# Altium schematic sheet TPS2663.SchDoc
size 431 x 279 mm; Date: Not shown in title block; ApprovedBy: Not shown in title block; CheckedBy: Not shown in title block; Author: Not shown in title block; CompanyName: Not shown in title block; DrawnBy: Andy Lin (TI); Engineer: Not shown in title block; Organization: Not shown in title block; Address1: Not shown in title block; Address2: Not shown in title block; Address3: Not shown in title block; Address4: Not shown in title block; DocumentNumber: 5; Revision: Use project parameter SCH_Rev; SheetNumber: 5; SheetTotal: 14; PageSetup: Record=PageOptions|CenterHorizontal=True|CenterVertical=True|PrintScale=1.00|XCorrection=1.00|YCorrection=1.00|PrintKind=0|BorderSize=5000000|LeftOffset=0|BottomOffset=0|Orientation=2|PaperLength=1000|PaperWidth=1000|Scale=100|PaperSource=15|PrintQuality=600|MediaType=1|DitherType=10|PaperKind=Letter|PrintScaleMode=1; CurrentTime: Not shown in title block; CurrentDate: Not shown in title block; Time: Not shown in title block; DocumentFullPathAndName: Not shown in title block; DocumentName: Not shown in title block; ModifiedDate: Not shown in title block; ImagePath: Not shown in title block
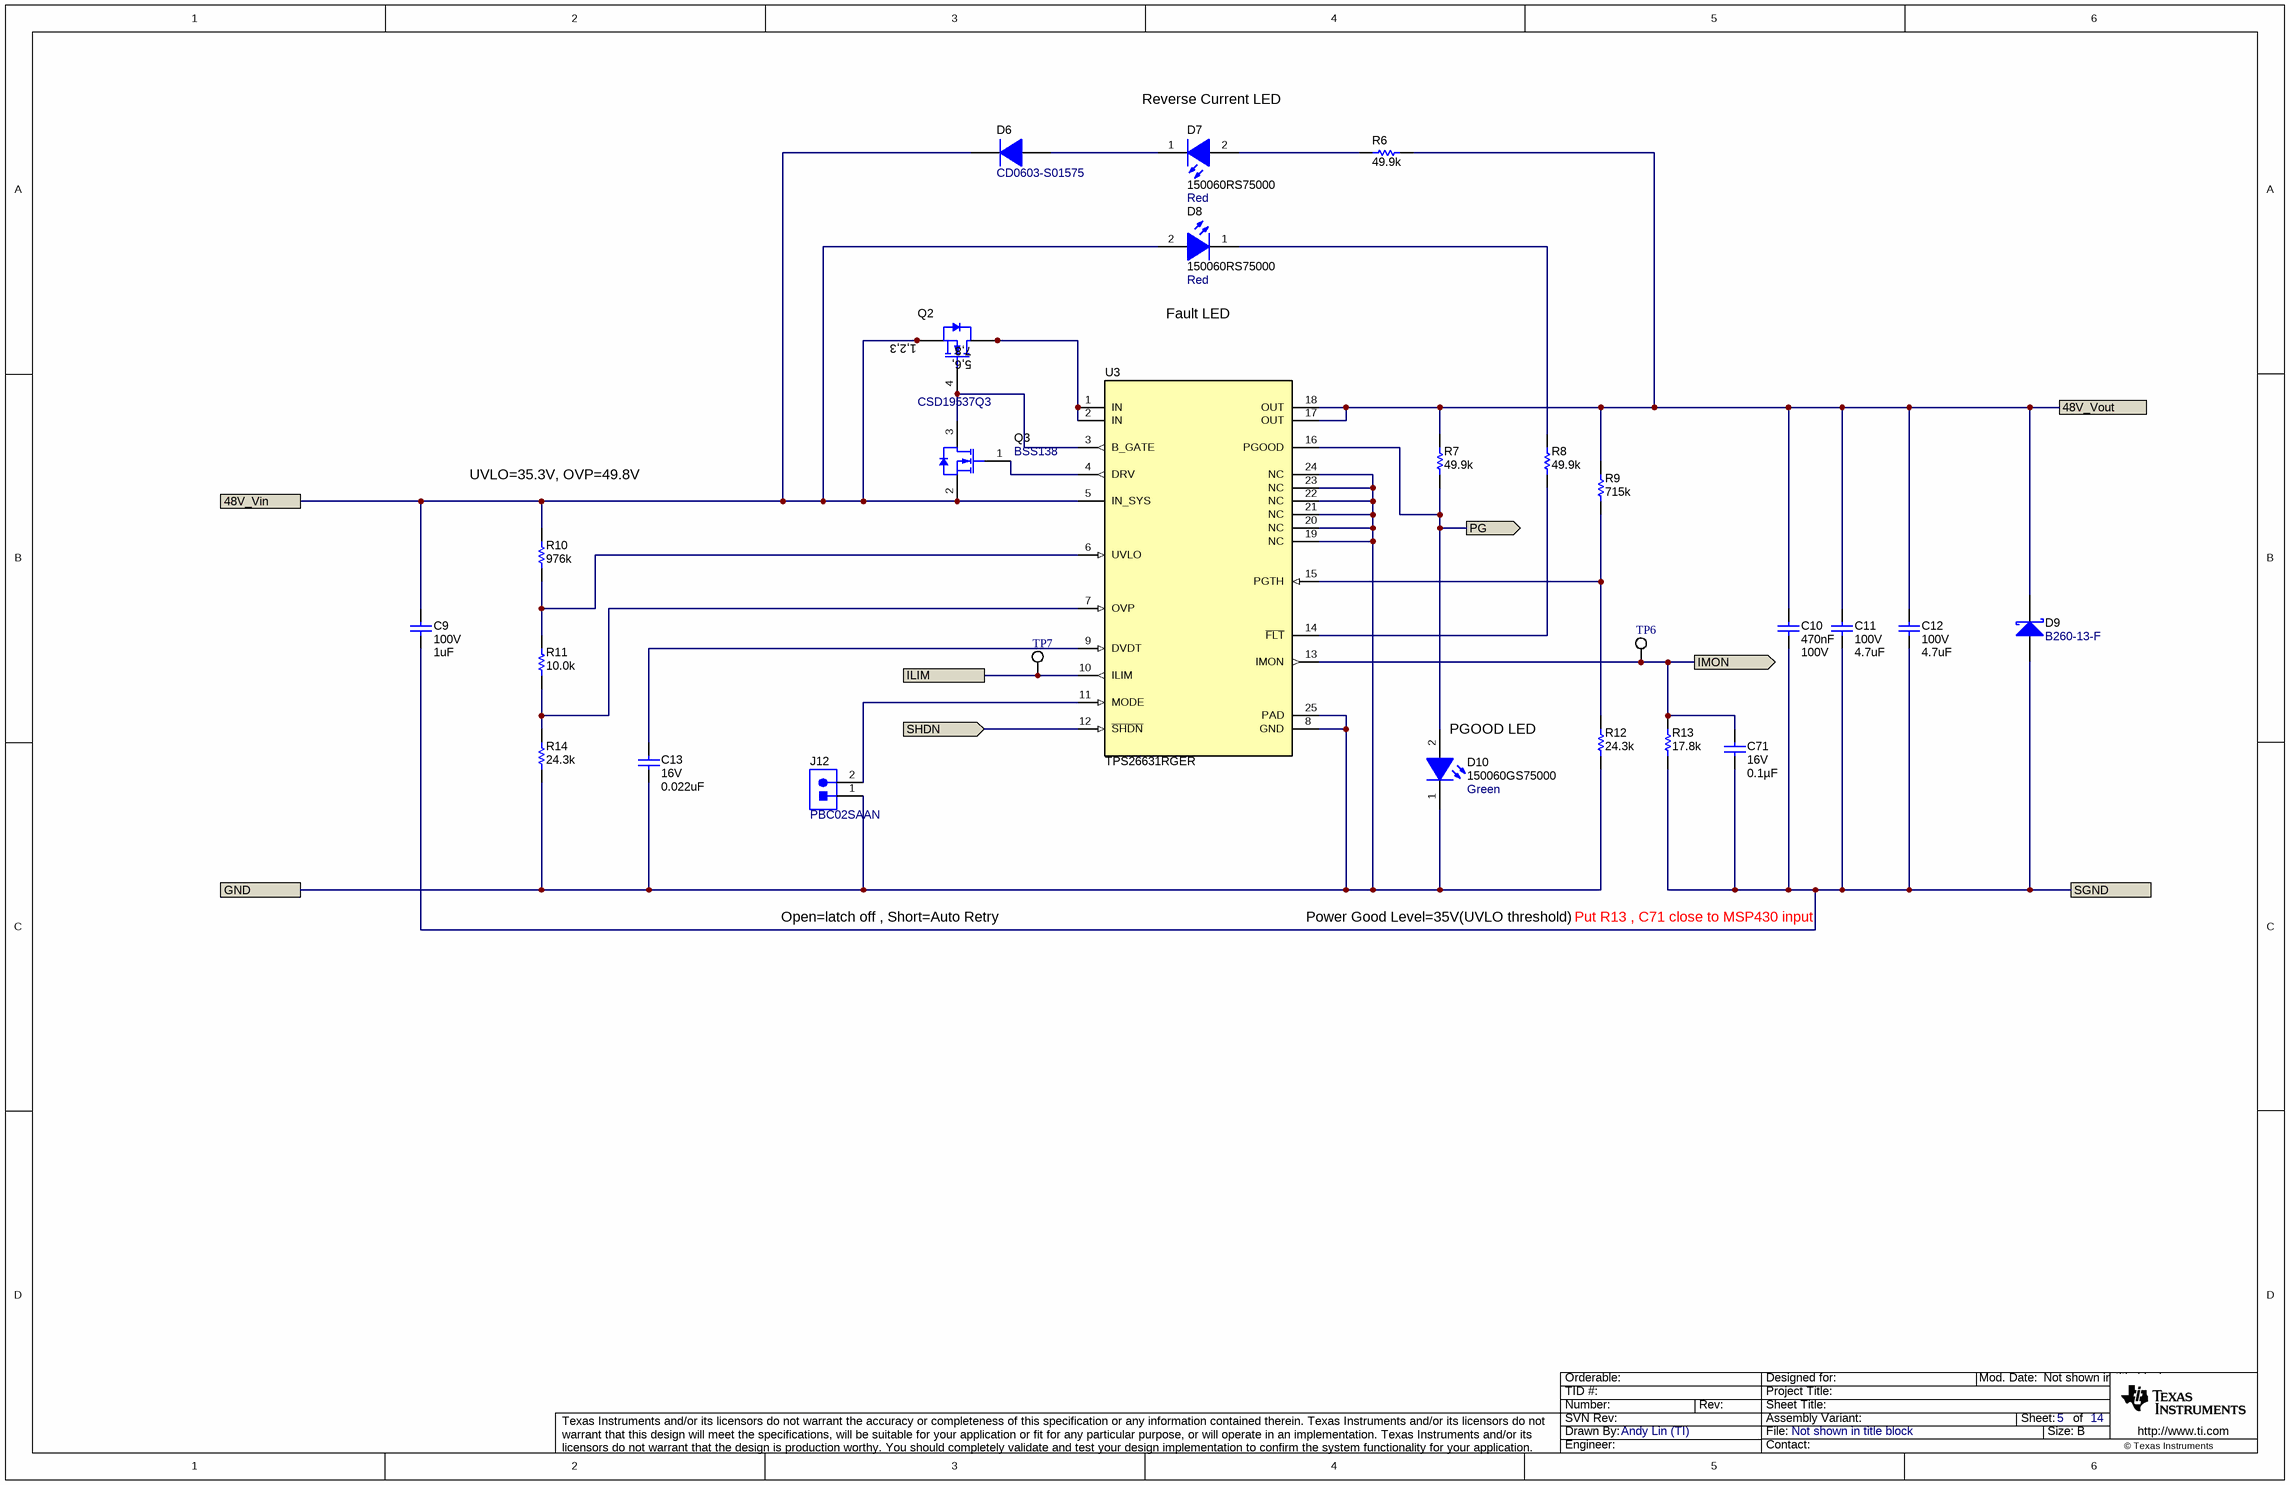
[diagram p0: TPS2663.SchDoc]

## Parts
C9  VDC_V: 100V  ValueDisplayed: 1uF  [1206_180]  (hidden comment: GRM31CR72A105KA01L)
C10  Cap_F: 470nF  VDC_V: 100V  [0805_HV]  (hidden comment: GRM21BR72A474KA73L)
C11  VDC_V: 100V  ValueDisplayed: 4.7uF  [1210_220]  (hidden comment: GRM32DC72A475KE01L)
C12  VDC_V: 100V  ValueDisplayed: 4.7uF  [1210_220]  (hidden comment: GRM32DC72A475KE01L)
C13  VDC_V: 16V  ValueDisplayed: 0.022uF  [0402]  (hidden comment: GRM155R71C223KA01D)
C71  VDC_V: 16V  ValueDisplayed: 0.1µF  [0402]  (hidden comment: GCM155R71C104JA55D)
D6  CD0603-S01575  [Diode_0603]
D7  150060RS75000  value Red  [WL-SMCW_RED]
D8  150060RS75000  value Red  [WL-SMCW_RED]
D9  B260-13-F  [SMB]
D10  150060GS75000  value Green  [WL-SMCW_GREEN]
J12  PBC02SAAN  [Sullins_PBC02SAAN]
Q2  CSD19537Q3  [DQG0008A]
Q3  BSS138  [SOT-23]
R6  ValueDisplayed: 49.9k  [0603]  (hidden comment: CRCW060349K9FKEA)
R7  ValueDisplayed: 49.9k  [0603]  (hidden comment: CRCW060349K9FKEA)
R8  ValueDisplayed: 49.9k  [0603]  (hidden comment: CRCW060349K9FKEA)
R9  ValueDisplayed: 715k  [0402]  (hidden comment: CRCW0402715KFKED)
R10  ValueDisplayed: 976k  [0402]  (hidden comment: CRCW0402976KFKED)
R11  ValueDisplayed: 10.0k  [0402]  (hidden comment: CRCW040210K0FKED)
R12  ValueDisplayed: 24.3k  [0402]  (hidden comment: CRCW040224K3FKED)
R13  ValueDisplayed: 17.8k  [0402]  (hidden comment: CRCW040217K8FKED)
R14  ValueDisplayed: 24.3k  [0402]  (hidden comment: CRCW040224K3FKED)
TP6  5002  [Keystone5002]  (value not drawn)
TP7  5002  [Keystone5002]  (value not drawn)
U3  TPS26631RGER  [RGE0024H]

## Ports
48V_Vin, 48V_Vout, GND, ILIM, IMON (out), PG (out), SGND, SHDN (in)

## Nets
48V_Vin: C9.1 D6.1(K) D8.2(A) Q2.1(S) Q2.2(S) Q2.3(S) Q3.2(S) R10.2 U3.5(IN_SYS) ; port 48V_Vin
48V_Vout: C10.1 C11.1 C12.1 D9.1(K) R6.1 R7.2 R9.2 U3.17(OUT) U3.18(OUT) ; port 48V_Vout
GND: C13.2 D10.1(K) J12.1 R12.1 R14.1 U3.8(GND) U3.19(NC) U3.20(NC) U3.21(NC) U3.22(NC) U3.23(NC) U3.24(NC) U3.25(PAD) ; port GND
ILIM: TP7.1 U3.10(ILIM) ; port ILIM
IMON: C71.1 R13.2 TP6.1 U3.13(IMON) ; port IMON
PG: D10.2(A) R7.1 U3.16(PGOOD) ; port PG
SGND: C9.2 C10.2 C11.2 C12.2 C71.2 D9.2(A) R13.1 ; port SGND
SHDN: U3.12(~{SHDN}) ; port SHDN
NetC13_1: C13.1 U3.9(DVDT)
NetD6_2: D6.2(A) D7.1(K)
NetD7_2: D7.2(A) R6.2
NetD8_1: D8.1(K) R8.2
NetJ12_2: J12.2 U3.11(MODE)
NetQ2_4: Q2.4(G) Q3.3(D) U3.3(B_GATE)
NetQ2_5: Q2.5(D) Q2.6(D) Q2.7(D) Q2.8(D) Q2.9(D) U3.1(IN) U3.2(IN)
NetQ3_1: Q3.1(G) U3.4(DRV)
NetR8_1: R8.1 U3.14(~{FLT})
NetR9_1: R9.1 R12.2 U3.15(PGTH)
NetR10_1: R10.1 R11.2 U3.6(UVLO)
NetR11_1: R11.1 R14.2 U3.7(OVP)

## Notes on the sheet
- (near D7) Reverse Current LED
- Fault LED
- UVLO=35.3V, OVP=49.8V
- (near D10) PGOOD LED
- Open=latch off , Short=Auto Retry
- Power Good Level=35V(UVLO threshold)
- Put R13 , C71 close to MSP430 input
- Drawn By:
- SVN Rev:
- Number:
- TID #:
- Orderable:
- Rev:
- Sheet Title:
- File:
- Project Title:
- Designed for:
- Assembly Variant:
- Mod. Date:
- Sheet:
- Size:
- of
- B
- http://www.ti.com
- Texas Instruments and/or its licensors do not warrant the accuracy or completeness of this specification or any information contained therein. Texas Instruments and/or its licensors do not warrant that this design will meet the specifications, will be suitable for your application or fit for any particular purpose, or will operate in an implementation. Texas Instruments and/or its licensors do not warrant that the design is production worthy. You should completely validate and test your design implementation to confirm the system functionality for your application.
- Engineer:
- Contact:
- © Texas Instruments
- (in symbol CMP-0000967-2) 1,2,3; 7,8; 5,6,

## Library data of the parts
C9 = CMP-0008970-1: CAP, CERM, 1 uF, 100 V, +/- 10%, X7R, 1206; Manufacturer: MuRata; TaMin_C: -55°C; Polarized: N; SizeAreaWB_mm2: 10.92; Value1: Unknown; U/M: EA; Value: 1uF; TaMax_C: 125°C; SizeZ_mm: 1.8; SizeX_mm: 3.2; SizeY_mm: 1.6; Cap_Case: 2220; SizeArea_mm2: 5.12; Cap_F: 1µF; AEC Category: Q200; ComponentLink1URL: http://search.murata.co.jp/Ceramy/PnsearchViewAction.do?HnOFG=ON&HnNFG=ON&SEL_CNT=50&sLang=en&sKey=GRM31CR72A105KA01L&x=9&y=9&search=startwith; Supplier Part Number 2: 81-GRM31CR72A105KA01; Publisher: Texas Instruments; Supplier 2: Mouser; Supplier Part Number 3: 1735543; TempCo: X7R; Supplier 3: Farnell; Published: 2008-06-19; RoHS: Y; MountType: SMT; Supplier 1: Digi-Key; PackageReference: 1206; Tolerance_%: 10%; Value2: 100V; CompType: Capacitor; LatestRevisionDate: 2017-03-09; PartNumber: GRM31CR72A105KA01L; AEC Qualified: ?; ComponentLink1Description: Datasheet link; Supplier Part Number 1: 490-3909-1-ND; Technology: Ceramic
C10 = CMP-0008374-2: CAP, CERM, 0.47 uF, 100 V, +/- 10%, X7R, 0805; Manufacturer: MuRata; TaMin_C: -55°C; Polarized: N; SizeAreaWB_mm2: 6.75; Value1: Unknown; U/M: EA; Value: 0.47uF; TaMax_C: 125°C; SizeZ_mm: 1.45; SizeX_mm: 2; SizeY_mm: 1.25; Cap_Case: 0805; SizeArea_mm2: 2.5; AEC Category: Q200; Supplier Part Number 2: 81-GRM21BR72A474KA73; Publisher: Texas Instruments; Supplier 2: Mouser; TempCo: X7R; Published: 2008-06-19; RoHS: Y; MountType: SMT; Supplier 1: Digi-Key; PackageReference: 0805; Tolerance_%: 10%; Value2: 100V; CompType: Capacitor; LatestRevisionDate: 2017-03-09; PartNumber: GRM21BR72A474KA73L; AEC Qualified: ?; ComponentLink1Description: Datasheet link; Supplier Part Number 1: 490-3326-1-ND; Technology: Ceramic; ValueDisplayed: 0.47uF; ComponentLink1URL: http://search.murata.co.jp/Ceramy/PnsearchViewAction.do?HnOFG=ON&HnNFG=ON&SEL_CNT=50&sLang=en&sKey=GRM21BR72A474KA73L&x=9&y=9&search=startwith
C11 C12 = CMP-0009182-2: CAP, CERM, 4.7 uF, 100 V, +/- 10%, X7S, 1210; Manufacturer: MuRata; TaMin_C: -55°C; Polarized: N; SizeAreaWB_mm2: 14.7; Value1: Unknown; U/M: EA; Value: 4.7uF; TaMax_C: 125°C; SizeZ_mm: 2.2; SizeX_mm: 3.2; SizeY_mm: 2.5; Cap_Case: 1210; SizeArea_mm2: 8; Cap_F: 4.7µF; AEC Category: Q200; Publisher: Texas Instruments; TempCo: X7S; Published: 2008-06-19; RoHS: Y; MountType: SMT; Supplier 1: Mouser; PackageReference: 1210; Tolerance_%: 10%; Value2: 100V; CompType: Capacitor; LatestRevisionDate: 2017-03-09; PartNumber: GRM32DC72A475KE01L; AEC Qualified: N; ComponentLink1Description: Datasheet link; AEC Grade: N/A; Supplier Part Number 1: 81-GRM32DC72A475KE1L; Technology: Ceramic; ComponentLink1URL: http://search.murata.co.jp/Ceramy/image/img/A01X/G101/ENG/GRM32DC72A475KE01-01.pdf
C13 = CMP-0006647-2: CAP, CERM, 0.022 uF, 16 V, +/- 10%, X7R, 0402; Manufacturer: MuRata; TaMin_C: -55°C; Polarized: N; SizeAreaWB_mm2: 3; Value1: Unknown; U/M: EA; TaMax_C: 125°C; SizeZ_mm: 0.6; SizeX_mm: 1; SizeY_mm: 0.5; Cap_F: 22nF; AEC Category: Q200; Supplier Part Number 2: 81-GRM36X223K16; Publisher: Texas Instruments; Supplier 2: Mouser; Supplier Part Number 3: 1828865; TempCo: X7R; Supplier 3: Farnell; Published: 2008-06-19; RoHS: Y; MountType: SMT; Value: 0.022uF; Supplier 1: Digi-Key; PackageReference: 0402; Tolerance_%: 10%; Cap_Case: 0402; Value2: 16V; SizeArea_mm2: 0.5; CompType: Capacitor; LatestRevisionDate: 2017-03-09; PartNumber: GRM155R71C223KA01D; AEC Qualified: ?; ComponentLink1Description: Datasheet link; Supplier Part Number 1: 490-3256-1-ND; Technology: Ceramic; ComponentLink1URL: http://search.murata.co.jp/Ceramy/PnsearchViewAction.do?HnOFG=ON&HnNFG=ON&SEL_CNT=50&sLang=en&sKey=GRM155R71C223KA01D&x=9&y=9&search=startwith
C71 = CMP-0080702-1: CAP, CERM, 0.1 µF, 16 V,+/- 5%, X7R, AEC-Q200 Grade 1, 0402; Manufacturer: MuRata; Cap_F: 100nF; SizeAreaWB_mm2: 3; SizeArea_mm2: 0.5; AEC Qualified: Y; AEC Category: Q200; Value: 0.1uF; TaMax_C: 125°C; SizeZ_mm: 0.6; AEC Grade: 1; Polarized: N; TaMin_C: -55°C; U/M: EA; ComponentLink1Description: Datasheet link; RoHS: Y; Tolerance_%: 5%; Supplier 1: Digi-Key; PackageReference: 0402; Technology: Ceramic; PartNumber: GCM155R71C104JA55D; TempCo: X7R; Supplier Part Number 2: 81-GCM155R71C104JA5D; Supplier 2: Mouser; SizeY_mm: 0.5; Value2: 16V; ComponentLink1URL: https://search.murata.co.jp/Ceramy/image/img/A01X/G101/ENG/GCM155R71C104JA55-01.pdf; CompType: Capacitor; MountType: SMT; Supplier Part Number 1: 490-16433-1-ND; SizeX_mm: 1; Cap_Case: 0402
D6 = CMP-0029008-2: Diode, Switching, 100 V, 0.15 A, 0603 Diode; Manufacturer: Bourns; Vf_V: 1V; SizeAreaWB_mm2: 5.13; SizeX_mm: 1.7; Value1: 0.15A; Green_Lifecycle: Not Set; Io_A: 150mA; SizeArea_mm2: 1.53; SizeY_mm: 0.9; AEC Category: Q101; Vr_V: 100V; TJmax_C: 125°C; SizeZ_mm: 0.75; Green_REACh: Incomplete; Value: 100V; Green_EU RoHS: Incomplete; AEC Qualified: ?; Green_EU RoHS-2: Incomplete; MountType: SMT; CompType: Diode; ComponentLink1URL: http://www.bourns.com/pdfs/CD0603_1005.pdf; RoHS: Y; PartNumber: CD0603-S01575; PackageReference: 0603 Diode; Type: Switching; Value2: 1V; ComponentLink1Description: Datasheet link
D7 D8 = CMP-0002947-3: LED, Red, SMD; Manufacturer: Wurth Elektronik; Value1: 0.072W; Vf_V: 2V; Angle: 140; Tjmax_C: 85°C; Type: AlInGaP; Vr_V: 5V; Io_A: 30mA; Power_TotalModule: 72mW; RoHS: Y; Color: Red; ComponentLink1Description: Datasheet link; PackageReference: LED_0603; ComponentLink1URL: http://katalog.we-online.de/led/datasheet/150060RS75000.pdf; Value2: 2V; MountType: SMT; CompType: LED; PartNumber: 150060RS75000
D9 = CMP-0028406-2: Diode, Schottky, 60 V, 2 A, SMB; Manufacturer: Diodes Inc.; SizeArea_mm2: 21.336; Value1: 2A; Green_Lifecycle: Active; Vf_V: 700mV; SizeX_mm: 5.6; TJmax_C: 150°C; SizeZ_mm: 2.6; Green_REACh: Passed; Vr_V: 60V; Value2: 0.7V; RJC_CperW: 20; Value: 60V; AEC Category: Q101; SizeY_mm: 3.81; SizeAreaWB_mm2: 44.156; PackageReference: SMB; AEC Qualified: ?; Type: Schottky; Green_EU RoHS: Passed with Exemption; Green_EU RoHS-2: Passed; ComponentLink1Description: Datasheet link; Io_A: 2A; RoHS: Y; CompType: Diode; MountType: SMT; PartNumber: B260-13-F; ComponentLink1URL: http://www.diodes.com/datasheets/ds13004.pdf
D10 = CMP-0002905-2: LED, Green, SMD; Manufacturer: Wurth Elektronik; Value1: W; Type: InGaN; Value2: 3.2V; Io_A: 20mA; Angle: 140; Tjmax_C: 85°C; Color: Green; Vf_V: 3.2V; PartNumber: 150060GS75000; ComponentLink1Description: Datasheet link; ComponentLink1URL: http://katalog.we-online.de/led/datasheet/150060GS75000.pdf; MountType: SMT; PackageReference: LED_0603; CompType: LED; RoHS: Y
J12 = CMP-0054566-1: Header, 100mil, 2x1, Gold, TH; Manufacturer: Sullins Connector Solutions; CNHeader: TRUE; Current_A: 3A; Green_Lifecycle: Active; Shrouded: N; Gender: Male; Green_REACh: Passed; Voltage_V: 1.8kV; Row_Count: 1; Pitch_mm: 2.54; CT: FALSE; Cert_UL: Y; ComponentLink1URL: http://www.sullinscorp.com/catalogs/77_PAGE108-109_.100_MALE_HDR.pdf; ClassName: Header; Publisher: Texas Instruments; Color: Black; RoHS: Y; MountType: TH; Green_EU RoHS-2: Passed; Supplier 1: Digi-Key; Green_EU RoHS: Passed; PackageReference: Sullins 100mil, 1x2, 230 mil above insulator; PinCount: 2; CompType: Header; LatestRevisionDate: 26/05/2017; PartNumber: PBC02SAAN; Orientation: Vertical; ComponentLink1Description: Datasheet URL; Supplier Part Number 1: S1011E-02-ND; ContactFinish: Gold
Q2 = CMP-0000967-2: MOSFET, N-CH, 100 V, 50 A, DQG0008A (VSON-CLIP-8); Alternate Manufacturer: None; Manufacturer: Texas Instruments; SizeZ_mm: 1.1; ChType: N; Value2: 16 nC; VdsMax_V: 100V; SizeX_mm: 3.3; Vgs_V: 20V; QgTyp_nC: 16; Value: 100V; SizeArea_mm2: 10.89; AEC Category: Q101; IdsMax_A: 50A; SizeAreaWB_mm2: 18.49; U/M: EA; Supplier 2: Mouser; Supplier 1: Digi-Key; Supplier Part Number 1: CSD19537Q3-ND; Supplier Part Number 2: 595-CSD19537Q3; PartNumber: CSD19537Q3; ComponentLink1Description: Datasheet link; LatestRevisionDate: 2017-03-09; SizeY_mm: 3.3; CompType: MOSFET; LatestRevisionNote: Added parts.; Publisher: Texas Instruments; AEC Qualified: N; Published: 2008-06-19; RoHS: Y; PackageReference: DQG0008A; MountType: SMT; ComponentLink1URL: http://www.ti.com/lit/ds/symlink/csd19537q3.pdf
Q3 = CMP-0000755-1: MOSFET, N-CH, 50 V, 0.22 A, SOT-23; Alternate Manufacturer: None; Manufacturer: Fairchild Semiconductor; SizeZ_mm: 1.1; ChType: N; Value2: 1.7 nC; VdsMax_V: 50V; SizeX_mm: 2.5; SizeY_mm: 3; Vgs_V: 20V; Value: 50V; Rdson45_ohm: 6; SizeArea_mm2: 7.5; AEC Category: Q101; IdsMax_A: 220mA; SizeAreaWB_mm2: 14; U/M: EA; QgTyp_nC: 1.7; Supplier 2: Newark; Supplier 3: Mouser; Supplier 1: Digi-Key; Supplier Part Number 1: BSS138CT-ND; Supplier Part Number 2: 58K8769; PartNumber: BSS138; ComponentLink1Description: Datasheet link; LatestRevisionDate: 2017-03-09; ComponentLink1URL: http://www.fairchildsemi.com/ds/BS/BSS138.pdf; CompType: MOSFET; PackageReference: SOT-23; LatestRevisionNote: Added parts.; Publisher: Texas Instruments; AEC Qualified: ?; Published: 2008-06-19; Supplier Part Number 3: 512-BSS138; RoHS: Y; MountType: SMT
R6-R8 = CMP-0022447-1: RES, 49.9 k, 1%, 0.1 W, 0603; Manufacturer: Vishay-Dale; Power_W: 100mW; TempCo: 100 ppm/C; Value_Code: 49k9; U/M: EA; Value: 49.9k; EIA_Code: E96; SizeX_mm: 1.6; SizeY_mm: 0.8; SizeZ_mm: 1; Value2: 0.1W; SizeArea_mm2: 1.28; VDC_V: 75V; AEC Category: Q200; ComponentLink1URL: http://www.vishay.com/docs/20035/dcrcwe3.pdf; Supplier Part Number 2: 71-CRCW0603-49.9K-E3; Publisher: Texas Instruments; Supplier 2: Mouser; Supplier Part Number 3: 1652882; Supplier 3: Farnell; Published: 2008-06-26; RoHS: Y; Value1: 1%; MountType: SMT; Supplier 1: Digi-Key; PackageReference: 0603; Tolerance_%: 1%; Res_ohm: 49.9k; CompType: Resistor; LatestRevisionDate: 2017-03-09; PartNumber: CRCW060349K9FKEA; AEC Qualified: ?; ComponentLink1Description: Datasheet link; Supplier Part Number 1: 541-49.9KHCT-ND; Technology: Thick Film
R9 = CMP-0026533-2: RES, 715 k, 1%, 0.063 W, AEC-Q200 Grade 0, 0402; Manufacturer: Vishay-Dale; Power_W: 63mW; TempCo: 100 ppm/C; Value: 715k; EIA_Code: E96; SizeX_mm: 1; SizeY_mm: 0.5; SizeZ_mm: 0.6; Value2: 0.063W; AEC Qualified: Y; VDC_V: 50V; AEC Category: Q200; AEC Grade: 0; ComponentLink1URL: http://www.vishay.com/docs/20035/dcrcwe3.pdf; Supplier Part Number 2: 71-CRCW0402-715K-E3; Supplier 2: Mouser; Supplier Part Number 3: 1151471; Supplier 3: Farnell; Value_Code: 715k; RoHS: E; Value1: 1%; MountType: SMT; Supplier 1: Digi-Key; PackageReference: 0402; Tolerance_%: 1%; Res_ohm: 715k; SizeArea_mm2: 0.5; CompType: Resistor; PartNumber: CRCW0402715KFKED; ComponentLink1Description: Datasheet link; Supplier Part Number 1: 541-715KLCT-ND; Technology: Thick Film
R10 = CMP-0026615-3: RES, 976 k, 1%, 0.063 W, AEC-Q200 Grade 0, 0402; Manufacturer: Vishay-Dale; Power_W: 63mW; TempCo: 100 ppm/C; Value: 976k; EIA_Code: E96; SizeX_mm: 1; SizeY_mm: 0.5; SizeZ_mm: 0.6; Value2: 0.063W; AEC Qualified: Y; VDC_V: 50V; AEC Category: Q200; AEC Grade: 0; ComponentLink1URL: http://www.vishay.com/docs/20035/dcrcwe3.pdf; Supplier Part Number 2: 52K7358; Supplier 2: Newark; Supplier Part Number 3: 71-CRCW0402-976K-E3; Supplier 3: Mouser; Value_Code: 976k; RoHS: E; Value1: 1%; MountType: SMT; Supplier 1: Digi-Key; PackageReference: 0402; Tolerance_%: 1%; Res_ohm: 976k; SizeArea_mm2: 0.5; CompType: Resistor; PartNumber: CRCW0402976KFKED; ComponentLink1Description: Datasheet link; Supplier Part Number 1: 541-976KLCT-ND; Technology: Thick Film
R11 = CMP-0025958-3: RES, 10.0 k, 1%, 0.063 W, AEC-Q200 Grade 0, 0402; Manufacturer: Vishay-Dale; Power_W: 63mW; TempCo: 100 ppm/C; Value_Code: 10k0; Value: 10.0k; EIA_Code: E96; Res_ohm: 10k; SizeX_mm: 1; SizeY_mm: 0.5; SizeZ_mm: 0.6; Value2: 0.063W; AEC Qualified: Y; VDC_V: 50V; AEC Category: Q200; AEC Grade: 0; Supplier Part Number 2: 52K6595; Supplier 2: Newark; Supplier Part Number 3: 71-CRCW0402-10K-E3; Supplier 3: Mouser; RoHS: E; Value1: 1%; MountType: SMT; Supplier 1: Digi-Key; PackageReference: 0402; Tolerance_%: 1%; SizeArea_mm2: 0.5; CompType: Resistor; PartNumber: CRCW040210K0FKED; ComponentLink1Description: Datasheet link; Supplier Part Number 1: 541-10.0KLCT-ND; Technology: Thick Film; ComponentLink1URL: http://www.vishay.com/docs/20035/dcrcwe3.pdf
R12 R14 = CMP-0026195-2: RES, 24.3 k, 1%, 0.063 W, AEC-Q200 Grade 0, 0402; Manufacturer: Vishay-Dale; Power_W: 63mW; TempCo: 100 ppm/C; Value_Code: 24k3; Value: 24.3k; EIA_Code: E96; SizeX_mm: 1; SizeY_mm: 0.5; SizeZ_mm: 0.6; Value2: 0.063W; AEC Qualified: Y; VDC_V: 50V; AEC Category: Q200; AEC Grade: 0; ComponentLink1URL: http://www.vishay.com/docs/20035/dcrcwe3.pdf; Supplier Part Number 2: 52K6874; Supplier 2: Newark; Supplier Part Number 3: 71-CRCW0402-24.3K-E3; Supplier 3: Mouser; RoHS: E; Value1: 1%; MountType: SMT; Supplier 1: Digi-Key; PackageReference: 0402; Tolerance_%: 1%; Res_ohm: 24.3k; SizeArea_mm2: 0.5; CompType: Resistor; PartNumber: CRCW040224K3FKED; ComponentLink1Description: Datasheet link; Supplier Part Number 1: 541-24.3KLCT-ND; Technology: Thick Film
R13 = CMP-0026051-3: RES, 17.8 k, 1%, 0.063 W, AEC-Q200 Grade 0, 0402; Manufacturer: Vishay-Dale; Power_W: 63mW; TempCo: 100 ppm/C; Value_Code: 17k8; Value: 17.8k; EIA_Code: E96; SizeX_mm: 1; SizeY_mm: 0.5; SizeZ_mm: 0.6; Value2: 0.063W; AEC Qualified: Y; VDC_V: 50V; AEC Category: Q200; AEC Grade: 0; Supplier Part Number 2: 52K6746; Supplier 2: Newark; Supplier Part Number 3: 71-CRCW0402-17.8K-E3; Supplier 3: Mouser; RoHS: E; Value1: 1%; MountType: SMT; Supplier 1: Digi-Key; PackageReference: 0402; Tolerance_%: 1%; Res_ohm: 17.8k; SizeArea_mm2: 0.5; CompType: Resistor; PartNumber: CRCW040217K8FKED; ComponentLink1Description: Datasheet link; Supplier Part Number 1: 541-17.8KLCT-ND; Technology: Thick Film; ComponentLink1URL: http://www.vishay.com/docs/20035/dcrcwe3.pdf
TP6 TP7 = CMP-0055139-1: Test Point, Miniature, White, TH; Manufacturer: Keystone; CNHeader: FALSE; Green_Lifecycle: Active; Green_REACh: Passed; ContactFinish: Silver; CT: TRUE; ComponentLink1URL: http://www.keyelco.com/userAssets/file/M60-2p60.pdf; Supplier Part Number 2: 82H9632; Publisher: Texas Instruments; Supplier 2: Newark; Supplier Part Number 3: 534-5002; Color: White; Supplier 3: Mouser; RoHS: Y; MountType: TH; Green_EU RoHS-2: Passed; Supplier 1: Digi-Key; Green_EU RoHS: Passed; PackageReference: White Miniature Testpoint; CompType: Test Point; LatestRevisionDate: 26/05/2017; PartNumber: 5002; ComponentLink1Description: Datasheet URL; Supplier Part Number 1: 36-5002-ND
U3 = CMP-0080692-2: 4.5V - 60V, 6A 29mΩ eFuse with Reverse Polarity Protection, RGE0024H (VQFN-24); Alternate PartNumber: TPS26631RGET; Alternate Manufacturer: Texas Instruments; SizeX_mm: 4; AEC Qualified: N; AEC Category: Q200; SizeAreaWB_mm2: 25; SizeArea_mm2: 16; SizeZ_mm: 1; CompType: IC; ComponentLink1URL: http://www.ti.com/lit/ds/symlink/tps26631.pdf; PartNumber: TPS26631RGER; SizeY_mm: 4; ComponentLink3URL: http://www.ti.com/product/tps26631/datasheet; ComponentLink2URL: http://www.ti.com/product/tps26631; ComponentLink2Description: Product Folder; PackageReference: RGE0024H; PackageDescription: VQFN-24; ComponentLink3Description: Online Datasheet; MountType: SMT; ComponentLink1Description: Datasheet Link; Manufacturer: Texas Instruments